# EAGLE schematic pico-glitcher-v1 v43 (EAGLE 9.7.0)
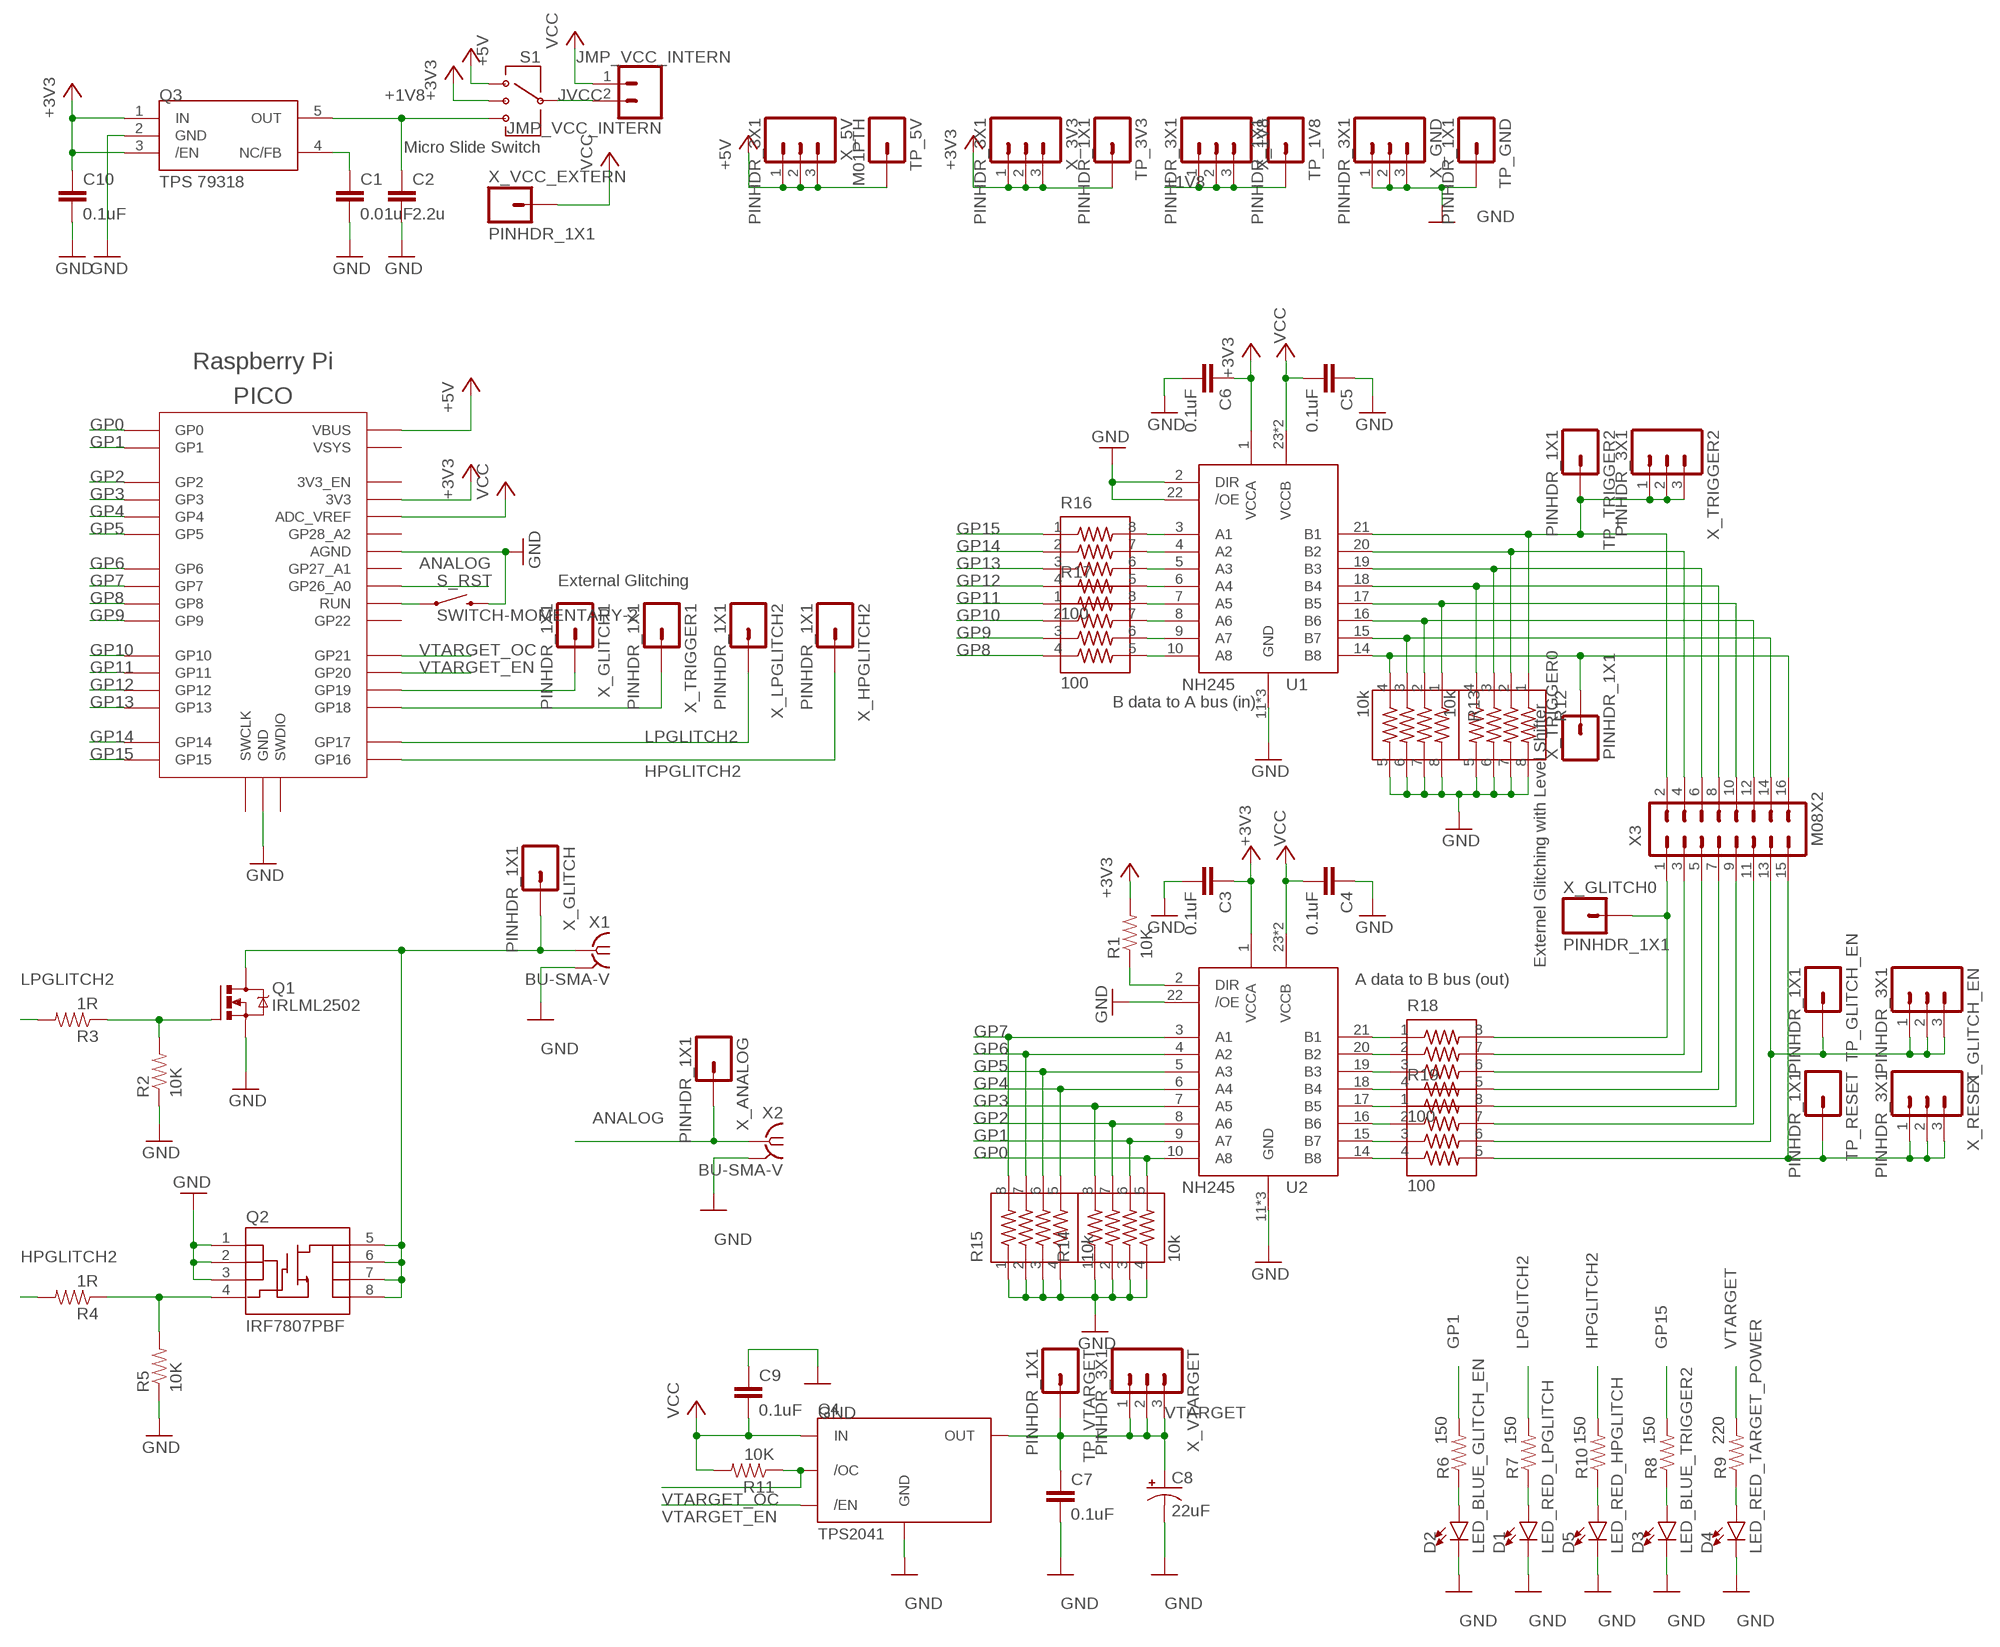
[diagram p0: schematic, sheet 1]

## Parts
C1  0.01uF  0.1UF-0603-25V-10%-X7R-WE  [0603]
C2  2.2u  CAP-0805  [0805]
C3  0.1uF  0.1UF-0603-25V-10%-X7R-WE  [0603]
C4  0.1uF  0.1UF-0603-25V-10%-X7R-WE  [0603]
C5  0.1uF  0.1UF-0603-25V-10%-X7R-WE  [0603]
C6  0.1uF  0.1UF-0603-25V-10%-X7R-WE  [0603]
C7  0.1uF  0.1UF-0603-25V-10%-X7R-WE  [0603]
C8  22uF  22UF-POLAR-PANASONIC_C-35V-20%  [PANASONIC_C]
C9  0.1uF  0.1UF-0603-25V-10%-X7R-WE  [0603]
C10  0.1uF  0.1UF-0603-25V-10%-X7R-WE  [0603]
D1  LED_RED_LPGLITCH  LED0603  [LED-0603]
D2  LED_BLUE_GLITCH_EN  LED0603  [LED-0603]
D3  LED_BLUE_TRIGGER2  LED0603  [LED-0603]
D4  LED_RED_TARGET_POWER  LED0603  [LED-0603]
D5  LED_RED_HPGLITCH  LED0603  [LED-0603]
JMP_VCC_INTERN  JMP_VCC_INTERN  CONN_02  [1X02]
PICO  Raspberry Pi  RPI_PICO-SMD  [RPI_PICO]
Q1  IRLML2502  NMOSFETSOT23-GSD  [SOT23]
Q2  IRF7807PBF  MOSFET-NCHANNEL-SOIC8  [SO08]
Q3  TPS 79318  TPS769XX  [SOT23-5L]
Q4  TPS2041  [SO08]
R1  10K  10KOHM1/10W1%(0603)0603  [0603-RES]
R2  10K  10KOHM1/10W1%(0603)0603  [0603-RES]
R3  1R  10KOHM1/10W1%(0603)0603  [0603-RES]
R4  1R  10KOHM1/10W1%(0603)0603  [0603-RES]
R5  10K  10KOHM1/10W1%(0603)0603  [0603-RES]
R6  150  10KOHM1/10W1%(0603)0603  [0603-RES]
R7  150  10KOHM1/10W1%(0603)0603  [0603-RES]
R8  150  10KOHM1/10W1%(0603)0603  [0603-RES]
R9  220  10KOHM1/10W1%(0603)0603  [0603-RES]
R10  150  10KOHM1/10W1%(0603)0603  [0603-RES]
R11  10K  10KOHM1/10W1%(0603)0603  [0603-RES]
R12  10k  742C083103JP  [742C083103JP]
R13  10k  742C083103JP  [742C083103JP]
R14  10k  742C083103JP  [742C083103JP]
R15  10k  742C083103JP  [742C083103JP]
R16  100  742C083103JP  [742C083103JP]
R17  100  742C083103JP  [742C083103JP]
R18  100  742C083103JP  [742C083103JP]
R19  100  742C083103JP  [742C083103JP]
S1  Micro Slide Switch  SWITCH-SP3T  [SWITCH-SP3T-SMD]
S_RST  SWITCH-MOMENTARY-2  [TACTILE_SWITCH_TALL]
TP_1V8  PINHDR_1X1  M01PTH  [1X01]
TP_3V3  PINHDR_1X1  M01PTH  [1X01]
TP_5V  M01PTH  [1X01]
TP_GLITCH_EN  PINHDR_1X1  M01PTH  [1X01]
TP_GND  PINHDR_1X1  M01PTH  [1X01]
TP_RESET  PINHDR_1X1  M01PTH  [1X01]
TP_TRIGGER2  PINHDR_1X1  M01PTH  [1X01]
TP_VTARGET  PINHDR_1X1  M01PTH  [1X01]
U1  NH245  NH245-SN74LVC8T245  [TSSOP24]
U2  NH245  NH245-SN74LVC8T245  [TSSOP24]
X1  BU-SMA-V  [BU-SMA-V]
X2  BU-SMA-V  [BU-SMA-V]
X3  M08X2  [2X8]
X_1V8  PINHDR_3X1  M03PTH  [1X03]
X_3V3  PINHDR_3X1  M03PTH  [1X03]
X_5V  PINHDR_3X1  M03PTH  [1X03]
X_ANALOG  PINHDR_1X1  M01PTH  [1X01]
X_GLITCH  PINHDR_1X1  M01PTH  [1X01]
X_GLITCH0  PINHDR_1X1  M01PTH  [1X01]
X_GLITCH1  PINHDR_1X1  M01PTH  [1X01]
X_GLITCH_EN  PINHDR_3X1  M03PTH  [1X03]
X_GND  PINHDR_3X1  M03PTH  [1X03]
X_HPGLITCH2  PINHDR_1X1  M01PTH  [1X01]
X_LPGLITCH2  PINHDR_1X1  M01PTH  [1X01]
X_RESET  PINHDR_3X1  M03PTH  [1X03]
X_TRIGGER0  PINHDR_1X1  M01PTH  [1X01]
X_TRIGGER1  PINHDR_1X1  M01PTH  [1X01]
X_TRIGGER2  PINHDR_3X1  M03PTH  [1X03]
X_VCC_EXTERN  PINHDR_1X1  M01PTH  [1X01]
X_VTARGET  PINHDR_3X1  M03PTH  [1X03]

## Nets
+1V8: C2.1 Q3.5(OUT) S1.4 TP_1V8.1 X_1V8.1 X_1V8.2 X_1V8.3
+3V3: C3.1 C6.1 C10.1 PICO.3V3 Q3.1(IN) Q3.3(/EN) R1.2 S1.2 TP_3V3.1 U1.1(VCCA) U2.1(VCCA) X_3V3.1 X_3V3.2 X_3V3.3
+5V: PICO.VBUS S1.1 TP_5V.1 X_5V.1 X_5V.2 X_5V.3
ANALOG: PICO.GP26_A0 X2.1 X_ANALOG.1
GLITCH: Q1.3(D) Q2.5(D) Q2.6(D) Q2.7(D) Q2.8(D) X1.1 X_GLITCH.1
GND: C1.2 C2.2 C3.2 C4.1 C5.1 C6.2 C7.2 C8.- C9.1 C10.2 D1.C D2.C D3.C D4.C D5.C PICO.AGND PICO.GND@1(GND) PICO.GND@2(GND) PICO.GND@3(GND) PICO.GND@4(GND) PICO.GND@5(GND) PICO.GND@6(GND) PICO.GND@7(GND) PICO.GND@8(GND) Q1.2(S) Q2.1(S) Q2.2(S) Q2.3(S) Q3.2(GND) Q4.1(GND) R2.1 R5.1 R12.5 R12.6 R12.7 R12.8 R13.5 R13.6 R13.7 R13.8 R14.1 R14.2 R14.3 R14.4 R15.1 R15.2 R15.3 R15.4 S_RST.B2 TP_GND.1 U1.2(DIR) U1.11(GND) U1.12(GND) U1.13(GND) U1.22(/OE) U2.11(GND) U2.12(GND) U2.13(GND) U2.22(/OE) X1.2 X1.3 X1.4 X1.5 X2.2 X2.3 X2.4 X2.5 X_GND.1 X_GND.2 X_GND.3
GP0: PICO.GP0 R14.5 U2.10(A8)
GP1: PICO.GP1 R6.2 R14.6 U2.9(A7)
GP2: PICO.GP2 R14.7 U2.8(A6)
GP3: PICO.GP3 R14.8 U2.7(A5)
GP4: PICO.GP4 R15.5 U2.6(A4)
GP5: PICO.GP5 R15.6 U2.5(A3)
GP6: PICO.GP6 R15.7 U2.4(A2)
GP7: PICO.GP7 R15.8 U2.3(A1)
GP8: PICO.GP8 R17.4
GP9: PICO.GP9 R17.3
GP10: PICO.GP10 R17.2
GP11: PICO.GP11 R17.1
GP12: PICO.GP12 R16.4
GP13: PICO.GP13 R16.3
GP14: PICO.GP14 R16.2
GP15: PICO.GP15 R8.2 R16.1
HPGLITCH2: PICO.GP16 R4.2 R10.2 X_HPGLITCH2.1
JVCC: JMP_VCC_INTERN.2 S1.3
LPGLITCH2: PICO.GP17 R3.2 R7.2 X_LPGLITCH2.1
N$1: D3.A R8.1
N$2: D1.A R7.1
N$3: Q1.1(G) R2.2 R3.1
N$4: D2.A R6.1
N$5: Q2.4(G) R4.1 R5.2
N$6: D4.A R9.1
N$7: D5.A R10.1
N$8: C1.1 Q3.4(NC/FB)
N$9: R18.1 U2.21(B1)
N$10: R18.2 U2.20(B2)
N$11: R18.3 U2.19(B3)
N$12: R18.4 U2.18(B4)
N$13: R19.1 U2.17(B5)
N$14: R19.2 U2.16(B6)
N$15: R19.3 U2.15(B7)
N$16: R19.4 U2.14(B8)
N$17: R16.8 U1.3(A1)
N$18: R16.7 U1.4(A2)
N$19: R16.6 U1.5(A3)
N$20: R16.5 U1.6(A4)
N$21: R17.8 U1.7(A5)
N$22: R17.7 U1.8(A6)
N$23: R17.6 U1.9(A7)
N$24: R17.5 U1.10(A8)
N$26: R12.1 TP_TRIGGER2.1 U1.21(B1) X3.2 X_TRIGGER2.1 X_TRIGGER2.2 X_TRIGGER2.3
N$33: R1.1 U2.2(DIR)
N$34: PICO.RUN S_RST.A2
N$37: PICO.GP19 X_GLITCH1.1
N$38: R19.5 TP_RESET.1 X3.15 X_RESET.1 X_RESET.2 X_RESET.3
N$39: R19.6 TP_GLITCH_EN.1 X3.13 X_GLITCH_EN.1 X_GLITCH_EN.2 X_GLITCH_EN.3
N$40: R19.7 X3.11
N$41: R19.8 X3.9
N$42: R18.5 X3.7
N$43: R18.6 X3.5
N$44: R18.7 X3.3
N$45: R18.8 X3.1 X_GLITCH0.1
N$47: R12.2 U1.20(B2) X3.4
N$48: R12.3 U1.19(B3) X3.6
N$49: R12.4 U1.18(B4) X3.8
N$50: R13.1 U1.17(B5) X3.10
N$51: R13.2 U1.16(B6) X3.12
N$52: R13.3 U1.15(B7) X3.14
N$53: R13.4 U1.14(B8) X3.16 X_TRIGGER0.1
N$54: PICO.GP18 X_TRIGGER1.1
VCC: C4.2 C5.2 C9.2 JMP_VCC_INTERN.1 PICO.ADC_VREF Q4.2(IN) Q4.3(IN) R11.2 U1.23(VCCB) U1.24(VCCB) U2.23(VCCB) U2.24(VCCB) X_VCC_EXTERN.1
VTARGET: C7.1 C8.+ Q4.6(OUT) Q4.7(OUT) Q4.8(OUT) R9.2 TP_VTARGET.1 X_VTARGET.1 X_VTARGET.2 X_VTARGET.3
VTARGET_EN: PICO.GP20 Q4.4(/EN)
VTARGET_OC: PICO.GP21 Q4.5(/OC) R11.1
Unconnected: PICO.3V3_EN PICO.GP22 PICO.GP27_A1 PICO.GP28_A2 PICO.SWCLK PICO.SWDIO PICO.VSYS

## Notes on the sheet
- External Glitching
- B data to A bus (in)
- Externel Glitching with Level Shifter
- A data to B bus (out)

## Library data of the parts
C1 = SparkFun-Capacitors:0.1UF: 0.1µF ceramic capacitors A capacitor is a passive two-terminal electrical component used to store electrical energy temporarily in an electric field.; PROD_ID: CAP-16503; VALUE: 0.1uF
C2 = SparkFun-Capacitors:CAP
C3-C7 C9 C10 = SparkFun-Capacitors:0.1UF: 0.1µF ceramic capacitors A capacitor is a passive two-terminal electrical component used to store electrical energy temporarily in an electric field.; PROD_ID: CAP-16503
C8 = SparkFun-Capacitors:22UF-POLAR: 22µF polarized capacitors A capacitor is a passive two-terminal electrical component used to store electrical energy temporarily in an electric field.; PROD_ID: CAP-08618
D1-D5 = SparkFun-LED:LED: LED (Generic) Standard schematic elements and footprints for 5mm, 3mm, 1206, and 0603 sized LEDs. Generic LEDs with no color specified.
JMP_VCC_INTERN = SparkFun-Connectors:CONN_02: Multi connection point. Often used as Generic Header-pin footprint for 0.1 inch spaced/style header connections On any of the 0.1 inch spaced packages, you can populate with these: Break Away Headers - Straight <https://www.sparkfun.com/products/116> (PRT-00116) Break Away Male Headers - Right Angle <https://www.sparkfun.com/products/553> (PRT-00553) Female Headers <https://www.sparkfun.com/products/115> (PRT-00115) Break Away Headers - Machine Pin <https://www.sparkfun.com/products/117> (PRT-00117) Break Away Female Headers - Swiss Machine Pin <https://www.sparkfun.com/products/743> (PRT-00743) For SCREWTERMINALS and SPRING TERMINALS visit here: Screw Terimnals on SparkFun.com <https://www.sparkfun.com/search/results?term=Screw+Terminals> (5mm/3.5mm/2.54mm spacing) This device is also useful as a general connection point to wire up your design to another part of your project. Our various solder wires solder well into these plated through hole pads. Hook-Up Wire - Assortment (Stranded, 22 AWG) <https://www.sparkfun.com/products/11375> (PRT-11375) Hook-Up Wire - Assortment (Solid Core, 22 AWG) <https://www.sparkfun.com/products/11367> (PRT-11367) View the entire wire category on our website here <https://www.sparkfun.com/categories/141> Special notes: Molex polarized connector foot print use with: PRT-08233 with associated crimp pins and housings. 2.54_SCREWTERM for use with PRT-10571. 3.5mm Screw Terminal footprints for PRT-08084 5mm Screw Terminal footprints for use with PRT-08432
PICO = RaspberryPi_Pico:RPI_PICO
Q1 = Transistor:NMOSFET: N-Channel MOSFET - Generic; CATEGORY: Transistor; SUB-CATEGORY: MOSFET; TYPE: N-Channel; VALUE: NMOSFET
Q2 = SparkFun:MOSFET-NCHANNEL-SOIC8: N-Channel MOSFET IRF9410 and NDS8434 are common, SOIC-8 parts.
Q3 = tps769xx:TPS769XX
Q4 = TPS2041:TPS2041
R1 R2 R5 R11 = SparkFun-Resistors:10KOHM1/10W1%(0603): RES-00824; PROD_ID: RES-00824
R3 R4 R6-R10 = SparkFun-Resistors:10KOHM1/10W1%(0603): RES-00824; PROD_ID: RES-00824; VALUE: 10K
R12-R19 = Resistor Array:742C083103JP: RES ARRAY 4 RES 10K OHM 1206 Manufacturer's datasheet <https://www.ctscorp.com/wp-content/uploads/74x.pdf>; CREATED_BY: PCBLayout.com; DIGIKEY_PN: 742C083103JPTR-ND; MANUFACTURER: CTS Resistor Products; MPN: 742C083103JP; PACKAGE: 1206
S1 = SparkFun:SWITCH-SP3T
S_RST = SparkFun:SWITCH-MOMENTARY-2
TP_1V8 TP_3V3 TP_5V TP_GLITCH_EN TP_GND TP_RESET TP_TRIGGER2 TP_VTARGET X_ANALOG X_GLITCH X_GLITCH0 X_GLITCH1 X_HPGLITCH2 X_LPGLITCH2 X_TRIGGER0 X_TRIGGER1 X_VCC_EXTERN = SparkFun-Connectors:M01: Header 1 Standard 1-pin 0.1" header. Use with straight break away headers (SKU : PRT-00116), right angle break away headers (PRT-00553), swiss pins (PRT-00743), machine pins (PRT-00117), and female headers (PRT-00115).
U1 U2 = TI_NH245_SN74LVC8T245:NH245-SN74LVC8T245
X1 X2 = con-coax:BU-SMA-V: FEMALE SMA CONNECTOR Radiall distributor RS 112-3794; OC_FARNELL: unknown; OC_NEWARK: unknown
X3 = SparkFun-Connectors:M08X2: .1" headers, two rows of 8 each
X_1V8 X_3V3 X_5V X_GLITCH_EN X_GND X_RESET X_TRIGGER2 X_VTARGET = SparkFun-Connectors:M03: Header 3 Standard 3-pin 0.1" header. Use with straight break away headers (SKU : PRT-00116), right angle break away headers (PRT-00553), swiss pins (PRT-00743), machine pins (PRT-00117), and female headers (PRT-00115). Molex polarized connector foot print use with SKU : PRT-08232 with associated crimp pins and housings.